# EAGLE design ICS-43434 (EAGLE 9.6.2)
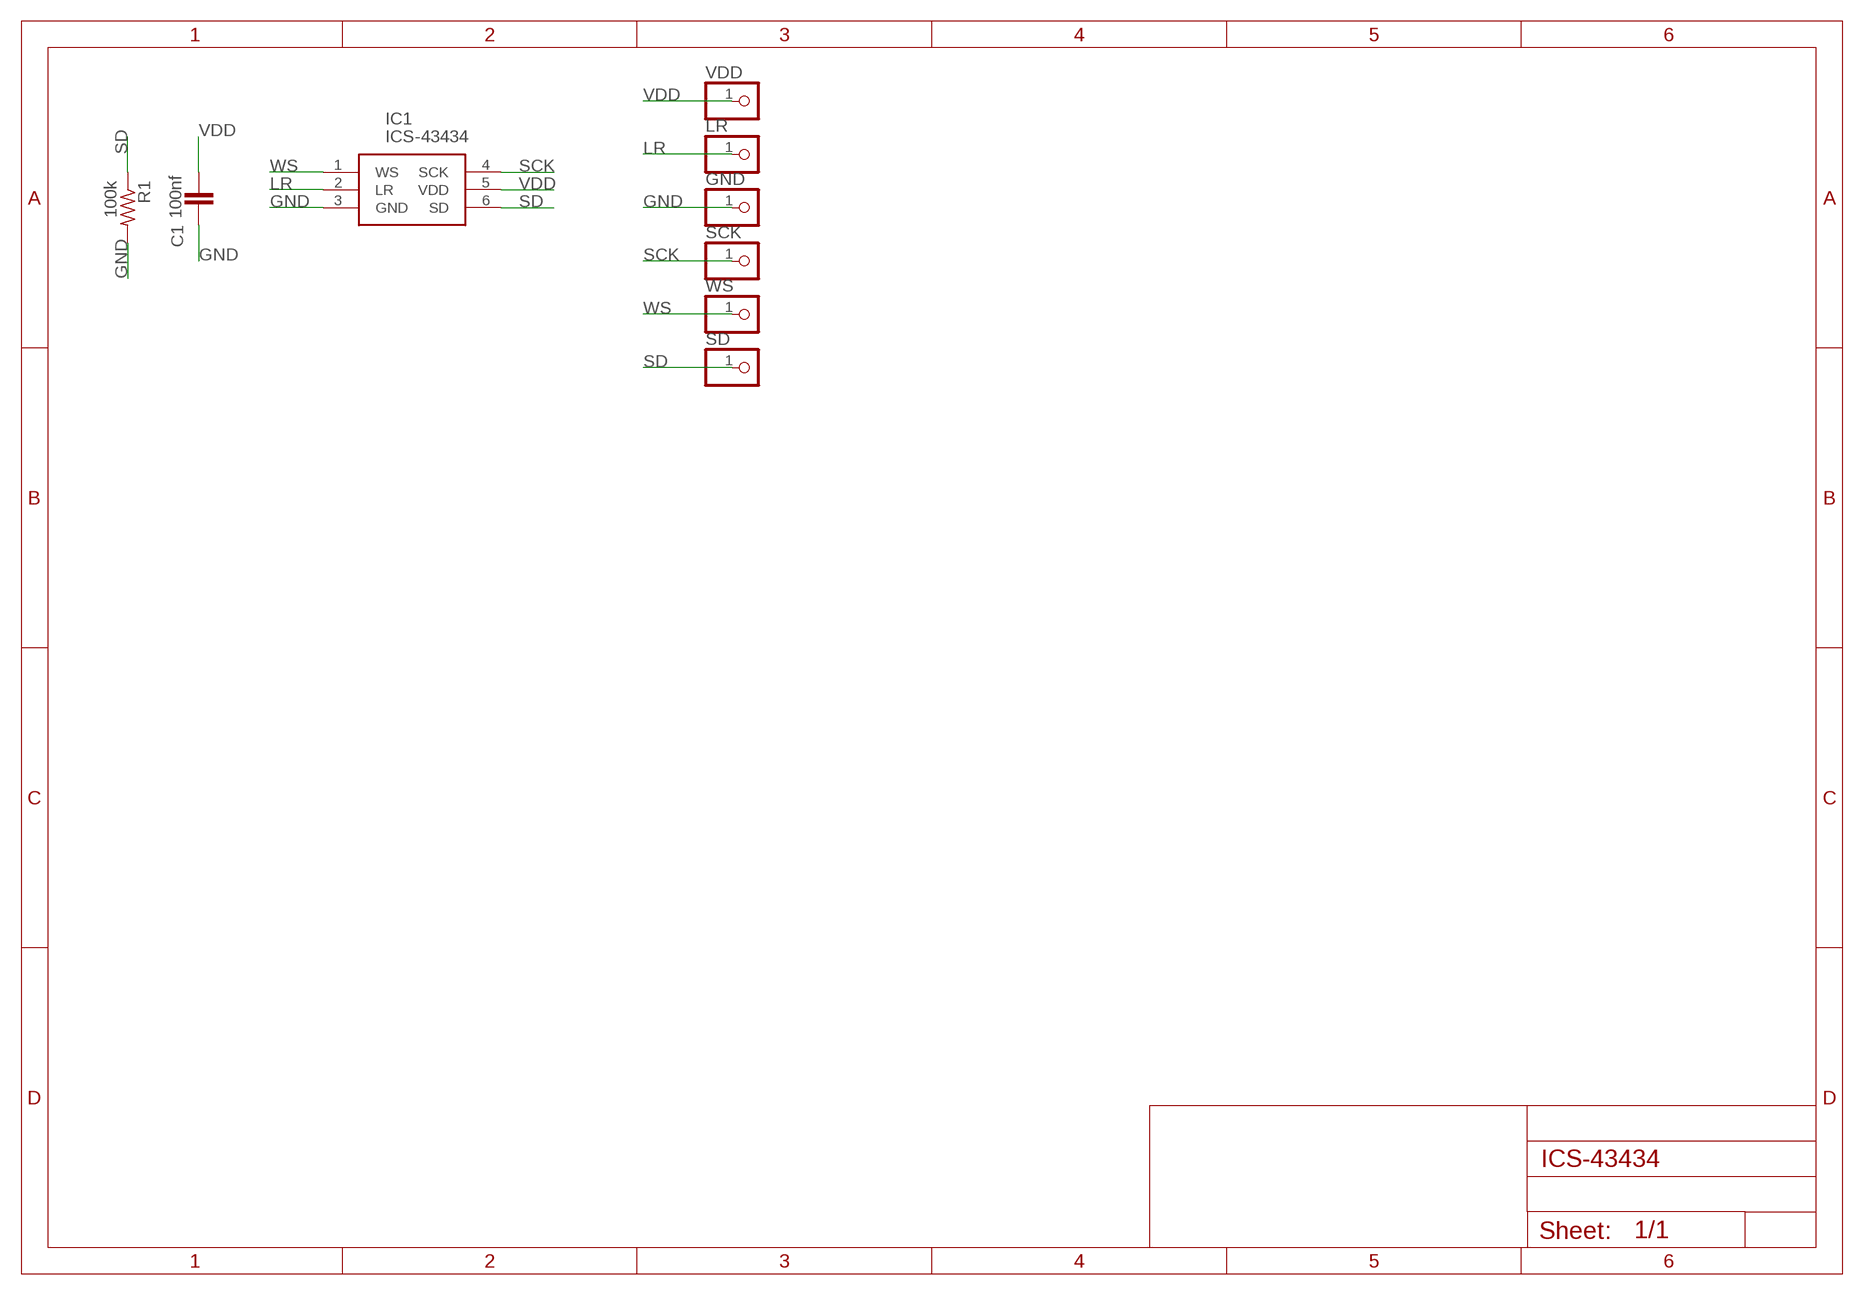
[diagram p0: schematic, sheet 1]

## Parts
C1  100nf  CC0805KRX7R9BB104  [CAP_0805]
GND  PINHD-1X1CB  [1X01-CLEANBIG]
IC1  ICS-43434  [ICS43434]
LR  PINHD-1X1CB  [1X01-CLEANBIG]
R1  100k  R-US_R0805  [R0805]
SCK  PINHD-1X1CB  [1X01-CLEANBIG]
SD  PINHD-1X1CB  [1X01-CLEANBIG]
VDD  PINHD-1X1CB  [1X01-CLEANBIG]
WS  PINHD-1X1CB  [1X01-CLEANBIG]

## Nets
GND: C1.1 GND.1 IC1.3(GND) R1.2
LR: IC1.2(LR) LR.1
SCK: IC1.4(SCK) SCK.1
SD: IC1.6(SD) R1.1 SD.1
VDD: C1.2 IC1.5(VDD) VDD.1
WS: IC1.1(WS) WS.1

## Library data of the parts
C1 = Resistor_Capacitor:CC0805KRX7R9BB104: CAP CER 0.1UF 50V X7R 0805 Manufacturer's datasheet <http://www.yageo.com/documents/recent/UPY-GPHC_X7R_6.3V-to-50V_18.pdf>; CREATED_BY: PCBLayout.com; DIGIKEY_PART_NUMBER: 311-1140-2-ND; MANUFACTURER: Yageo; MPN: CC0805KRX7R9BB104; PACKAGE: SMD 0805
GND LR SCK SD VDD WS = adafruit:PINHD-1X1: Pin header 1x1 for 0.1" spacing With round pins
IC1 = SamacSys_Parts:ICS-43434: MEMS Microphones (Microphone), SNR(Nom)=65dBA, LxWxT (mm)=3.5x2.65x0.98 Source: Datasheet <https://www.digikey.in/en/products/detail/tdk-invensense/ICS-43434/6140298?s=N4IgjCBcoCwdIDGUBmBDANgZwKYBoQB7KAbRAGZyAOKgdgCYQBdAgBwBcoQBldgJwCWAOwDmIAL4EYANiihkkdNnxFS4MDHoBOZm06Qe-YWMngtVHQgVLcBYpDIAGXSA5deg0RIIBaRlah+AFcVezIAVmZTH3h5VExbVQdwTSoo01kEA>; DESCRIPTION: MEMS Microphones (Microphone), SNR(Nom)=65dBA, LxWxT (mm)=3.5x2.65x0.98; HEIGHT: 0.98mm; MANUFACTURER_NAME: TDK; MANUFACTURER_PART_NUMBER: ICS-43434; MOUSER_PART_NUMBER: 410-ICS-43434; MOUSER_PRICE-STOCK: https://www.mouser.co.uk/ProductDetail/TDK-InvenSense/ICS-43434?qs=u4fy%2FsgLU9PAgmWRI7%252BqXA%3D%3D
R1 = rcl:R-US_: RESISTOR, American symbol; SPICEPREFIX: R

## Board
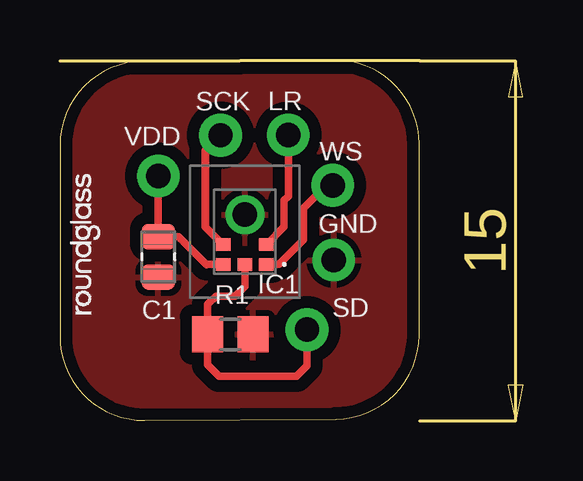
[diagram p1: board, top side]
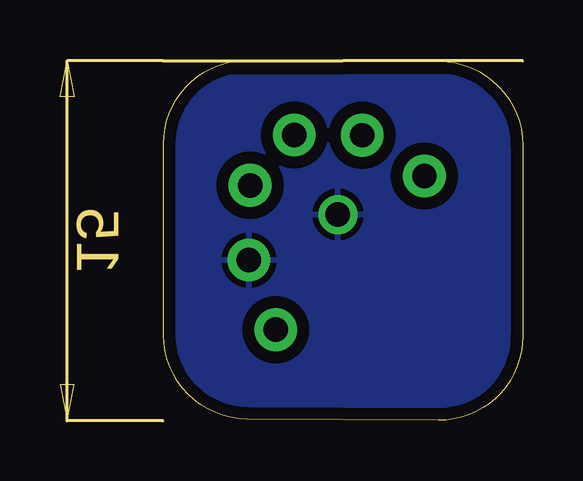
[diagram p2: board, bottom side, seen from below]

Size 14.98 x 15.01 mm. Coordinates in mm from the lower left corner, seen from the top.
Outline: 11.46,15.01 3.48,14.96 arc90 0,11.46 0,3.5 arc90 3.52,0 11.5,0.05 arc90 14.98,3.55 14.98,11.51 arc90 11.46,15.01
Copper layers (1*16): Top 0.035mm / dielectric 1.5mm / Bottom 0.035mm
Design rules "jotElectronics *": minimum track width 6mil, minimum drill 0.5mm, track to track 0.5mm, track to pad 0.4mm, pad to pad 6mil, via to via 0.25mm, smd to smd 0.25mm, copper to edge 0.5mm, drill to drill 0.5mm, minimum pad ring 10mil, minimum via ring 10mil, stop-mask expansion 4mil, vias tented up to drill 0mil, thermal gap 10mil

### Footprints (pad centres in the part's own frame; a part is rotated, then mirrored left to right if it is on the bottom)
CAP_0805 = smd 1.05 x 1.38: 1 -0.84,0; 2 0.84,0
1X01-CLEANBIG = drill 1.016 pad 1.778: 1 0,0
ICS43434 = smd 0.522 x 0.6: 1 -1.364,-0.9; 2 -0.542,-0.9; 4 -0.542,0.9; 5 -1.364,0.9; 6 -1.364,0 | drill 1.025 pad 1.625: 3 0.71,0
R0805 = smd 1.3 x 1.5: 1 -0.95,0; 2 0.95,0

### Placement (x,y rotation side)
C1  4.1,6.81 90 top
GND  11.42,6.68 0 top
IC1  7.71,7.86 90 top
LR  9.53,11.89 0 top
R1  7.1,3.58 0 top
SCK  6.7,11.88 0 top
SD  10.3,3.78 0 top
VDD  4.1,10.18 0 top
WS  11.37,9.79 0 top

### Tracks (layer width: path | path; a pad name or v marks a point on that pad's centre or on a via)
GND
  pour Top: 15,3.48 15,11.48 arc90 11.5,14.98 3.5,14.98 arc90 0,11.48 0,3.48 arc90 3.5,-0.02 11.5,-0.02 arc90
  pour Bottom: 15,3.48 15,11.48 arc90 11.5,14.98 3.5,14.98 arc90 0,11.48 0,3.48 arc90 3.5,-0.02 11.5,-0.02 arc90
LR
  Top 0.305: LR.1 9.53,9.34 9.35,9.16 9.35,8.06 IC1.2
SCK
  Top 0.305: 6.06,8.07 6.06,11.24 6.07,11.25 | SCK.1 6.07,11.25 | IC1.4 6.06,8.07 | 6.06,8.07 6.07,8.08 6.07,11.25
SD
  Top 0.305: IC1.6 7.71,5.58 7.3,5.18 6.5,5.18 6.15,4.83 R1.1 6.16,2.31 6.64,1.83 9.86,1.83 10.3,2.28 SD.1
VDD
  Top 0.152: 6.11,6.48 6.79,6.48 IC1.5
  Top 0.305: IC1.5 6.13,6.5 6.11,6.48 4.94,7.65 C1.2 VDD.1
WS
  Top 0.305: WS.1 11.12,9.79 10.15,8.83 10.15,7.52 9.14,6.51 8.62,6.51 IC1.1

### Text on the board
Name: Listen_Mic(I2S) V1